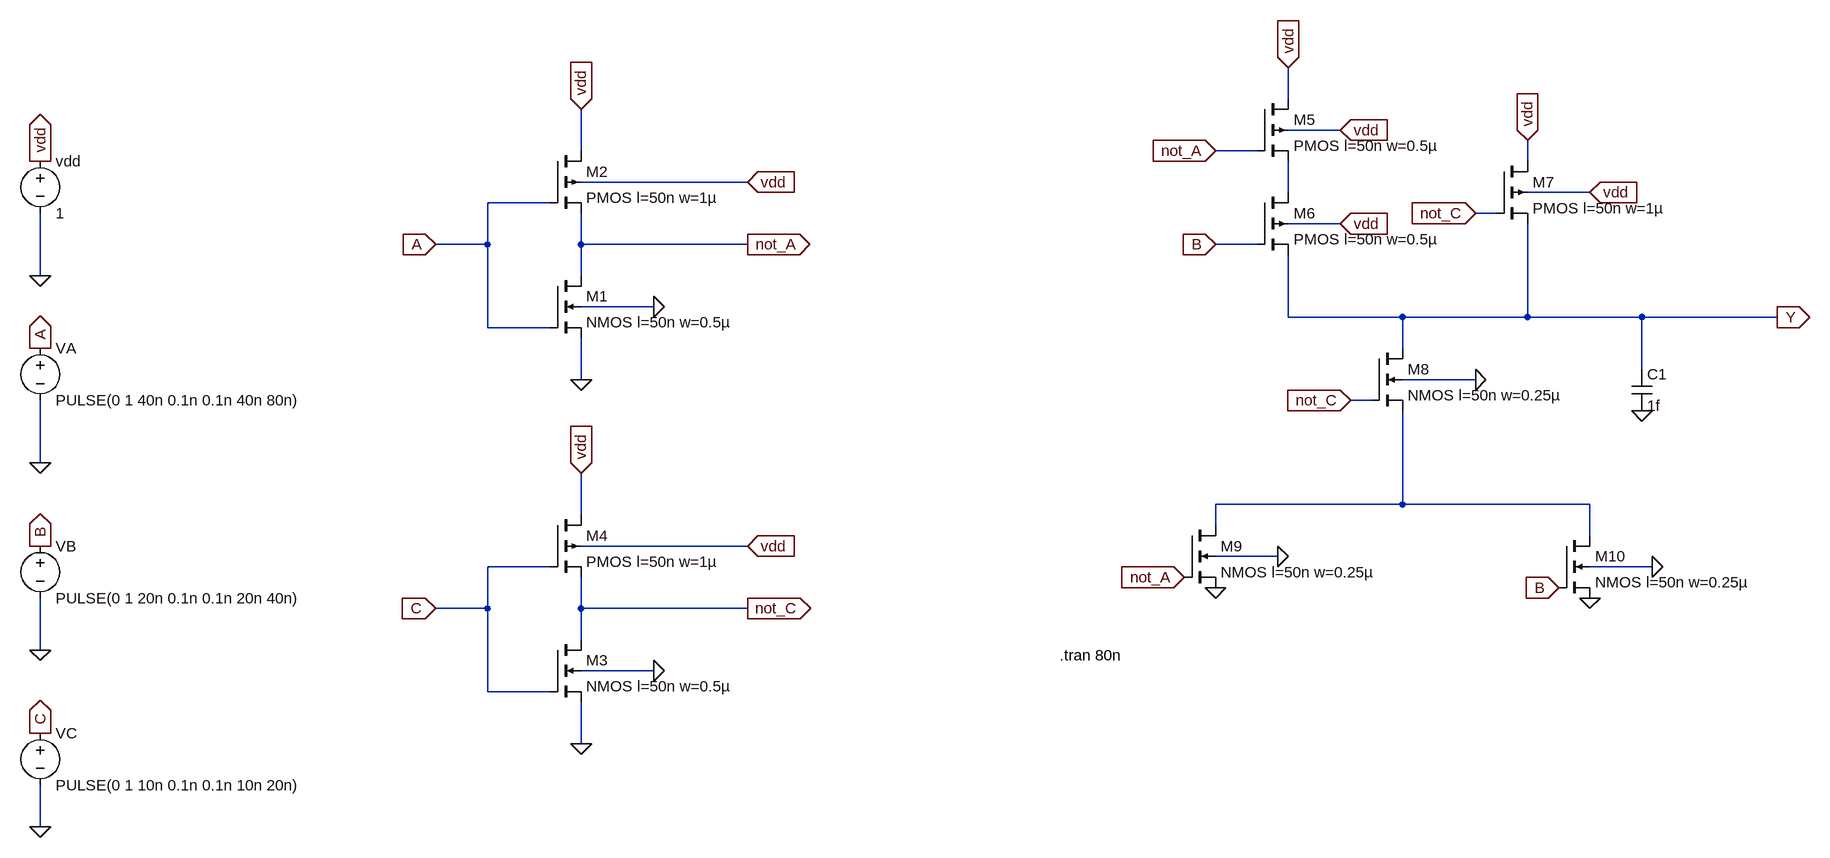
[diagram p0: schematic tran3Entrees.asc]
tran3Entrees.asc, the LTspice schematic file:
Version 4
SHEET 1 880 680
WIRE -288 -528 -288 -576
WIRE -208 -480 -288 -480
WIRE -1376 -448 -1376 -512
WIRE -336 -448 -400 -448
WIRE 80 -432 80 -464
WIRE -1120 -400 -1376 -400
WIRE -288 -384 -288 -432
WIRE 176 -384 80 -384
WIRE -1424 -368 -1520 -368
WIRE 32 -352 0 -352
WIRE -208 -336 -288 -336
WIRE -1520 -304 -1520 -368
WIRE -1520 -304 -1600 -304
WIRE -1376 -304 -1376 -352
WIRE -1120 -304 -1376 -304
WIRE -336 -304 -400 -304
WIRE -2208 -256 -2208 -352
WIRE -1376 -256 -1376 -304
WIRE -1264 -208 -1376 -208
WIRE -288 -192 -288 -288
WIRE -112 -192 -288 -192
WIRE 80 -192 80 -336
WIRE 80 -192 -112 -192
WIRE 256 -192 80 -192
WIRE 464 -192 256 -192
WIRE -1520 -176 -1520 -304
WIRE -1424 -176 -1520 -176
WIRE -112 -144 -112 -192
WIRE 256 -112 256 -192
WIRE -1376 -96 -1376 -160
WIRE 0 -96 -112 -96
WIRE -160 -64 -192 -64
WIRE -2208 32 -2208 -64
WIRE -112 96 -112 -48
WIRE -112 96 -400 96
WIRE 176 96 -112 96
WIRE -1376 112 -1376 48
WIRE -400 128 -400 96
WIRE 176 144 176 96
WIRE -1120 160 -1376 160
WIRE -304 176 -400 176
WIRE -1424 192 -1520 192
WIRE 272 192 176 192
WIRE -1520 256 -1520 192
WIRE -1520 256 -1600 256
WIRE -1376 256 -1376 208
WIRE -1120 256 -1376 256
WIRE -1376 304 -1376 256
WIRE -2208 320 -2208 240
WIRE -1264 352 -1376 352
WIRE -1520 384 -1520 256
WIRE -1424 384 -1520 384
WIRE -1376 464 -1376 400
WIRE -2208 592 -2208 528
FLAG -1120 -400 vdd
IOPIN -1120 -400 In
FLAG -1600 -304 A
IOPIN -1600 -304 In
FLAG -1376 -512 vdd
IOPIN -1376 -512 In
FLAG -1120 -304 not_A
IOPIN -1120 -304 Out
FLAG -1376 -96 0
FLAG -1264 -208 0
FLAG -1120 160 vdd
IOPIN -1120 160 In
FLAG -1600 256 C
IOPIN -1600 256 In
FLAG -1376 48 vdd
IOPIN -1376 48 In
FLAG -1120 256 not_C
IOPIN -1120 256 Out
FLAG -1376 464 0
FLAG -1264 352 0
FLAG -288 -576 vdd
IOPIN -288 -576 In
FLAG 80 -464 vdd
IOPIN 80 -464 In
FLAG -208 -480 vdd
IOPIN -208 -480 In
FLAG 176 -384 vdd
IOPIN 176 -384 In
FLAG -208 -336 vdd
IOPIN -208 -336 In
FLAG -400 -448 not_A
IOPIN -400 -448 In
FLAG -400 -304 B
IOPIN -400 -304 In
FLAG 0 -352 not_C
IOPIN 0 -352 In
FLAG 0 -96 0
FLAG 272 192 0
FLAG 176 240 0
FLAG -400 224 0
FLAG -304 176 0
FLAG -192 -64 not_C
IOPIN -192 -64 In
FLAG -448 208 not_A
IOPIN -448 208 In
FLAG 128 224 B
IOPIN 128 224 In
FLAG 464 -192 Y
IOPIN 464 -192 Out
FLAG 256 -48 0
FLAG -2208 -256 0
FLAG -2208 32 0
FLAG -2208 320 0
FLAG -2208 592 0
FLAG -2208 -432 vdd
IOPIN -2208 -432 Out
FLAG -2208 -144 A
IOPIN -2208 -144 Out
FLAG -2208 160 B
IOPIN -2208 160 Out
FLAG -2208 448 C
IOPIN -2208 448 Out
SYMBOL nmos4 -1424 -256 R0
SYMATTR InstName M1
SYMATTR Value NMOS l=50n w=0.5µ
SYMATTR Value2 l=50n w=0.5µ
SYMBOL pmos4 -1424 -448 R0
SYMATTR InstName M2
SYMATTR Value PMOS l=50n w=1µ
SYMATTR Value2 l=50n w=1µ
SYMBOL nmos4 -1424 304 R0
SYMATTR InstName M3
SYMATTR Value NMOS l=50n w=0.5µ
SYMATTR Value2 l=50n w=0.5µ
SYMBOL pmos4 -1424 112 R0
SYMATTR InstName M4
SYMATTR Value PMOS l=50n w=1µ
SYMATTR Value2 l=50n w=1µ
SYMBOL pmos4 -336 -528 R0
SYMATTR InstName M5
SYMATTR Value PMOS l=50n w=0.5µ
SYMATTR Value2 l=50n w=0.5µ
SYMBOL pmos4 -336 -384 R0
SYMATTR InstName M6
SYMATTR Value PMOS l=50n w=0.5µ
SYMATTR Value2 l=50n w=0.5µ
SYMBOL pmos4 32 -432 R0
SYMATTR InstName M7
SYMATTR Value PMOS l=50n w=1µ
SYMATTR Value2 l=50n w=1µ
SYMBOL nmos4 -160 -144 R0
SYMATTR InstName M8
SYMATTR Value NMOS l=50n w=0.25µ
SYMATTR Value2 l=50n w=0.25µ
SYMBOL nmos4 -448 128 R0
SYMATTR InstName M9
SYMATTR Value NMOS l=50n w=0.25µ
SYMATTR Value2 l=50n w=0.25µ
SYMBOL nmos4 128 144 R0
SYMATTR InstName M10
SYMATTR Value NMOS l=50n w=0.25µ
SYMBOL cap 240 -112 R0
SYMATTR InstName C1
SYMATTR Value 1f
SYMBOL voltage -2208 -448 R0
SYMATTR InstName vdd
SYMATTR Value 1
SYMBOL voltage -2208 -160 R0
WINDOW 123 0 0 Left 0
WINDOW 39 0 0 Left 0
SYMATTR InstName VA
SYMATTR Value PULSE(0 1 40n 0.1n 0.1n 40n 80n)
SYMBOL voltage -2208 144 R0
WINDOW 123 0 0 Left 0
WINDOW 39 0 0 Left 0
SYMATTR InstName VB
SYMATTR Value PULSE(0 1 20n 0.1n 0.1n 20n 40n)
SYMBOL voltage -2208 432 R0
WINDOW 123 0 0 Left 0
WINDOW 39 0 0 Left 0
SYMATTR InstName VC
SYMATTR Value PULSE(0 1 10n 0.1n 0.1n 10n 20n)
TEXT -640 328 Left 2 !.tran 80n

The netlist it stands for:
* tran3Entrees.asc
M1 not_A A 0 0 NMOS l=50n w=0.5µ l=50n w=0.5µ
M2 vdd A not_A vdd PMOS l=50n w=1µ l=50n w=1µ
M3 not_C C 0 0 NMOS l=50n w=0.5µ l=50n w=0.5µ
M4 vdd C not_C vdd PMOS l=50n w=1µ l=50n w=1µ
M5 vdd not_A N001 vdd PMOS l=50n w=0.5µ l=50n w=0.5µ
M6 N001 B Y vdd PMOS l=50n w=0.5µ l=50n w=0.5µ
M7 vdd not_C Y vdd PMOS l=50n w=1µ l=50n w=1µ
M8 Y not_C N002 0 NMOS l=50n w=0.25µ l=50n w=0.25µ
M9 N002 not_A 0 0 NMOS l=50n w=0.25µ l=50n w=0.25µ
M10 N002 B 0 0 NMOS l=50n w=0.25µ
C1 Y 0 1f
vdd vdd 0 1
VA A 0 PULSE(0 1 40n 0.1n 0.1n 40n 80n)
VB B 0 PULSE(0 1 20n 0.1n 0.1n 20n 40n)
VC C 0 PULSE(0 1 10n 0.1n 0.1n 10n 20n)
.model NMOS NMOS
.model PMOS PMOS
.lib standard.mos
.tran 80n
.backanno
.end